# EAGLE design led_saber (EAGLE 6.4)
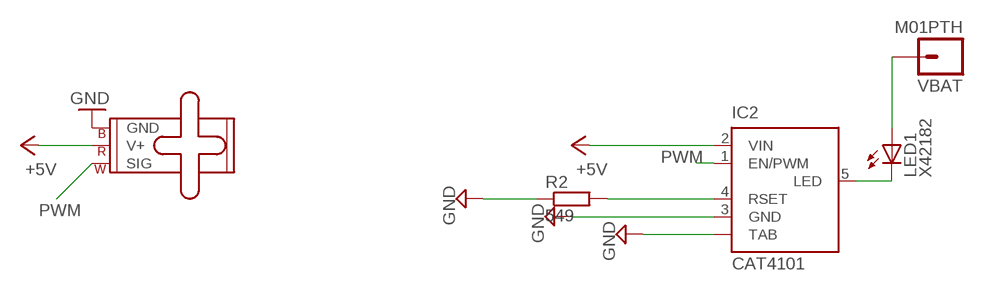
[diagram p0: schematic, sheet 1]

## Parts
IC2  CAT4101  [TO263_5]
LED  SMALL_SERVO  [1X03]
LED1  X42182  [Z-POWER-LED-DOME-TYPE]
R2  549  R-EU_R0805  [R0805]
VBAT  M01PTH  [1X01]

## Nets
+5V: IC2.2(VIN) LED.2(V+)
GND: IC2.3(GND) IC2.TAB LED.3(GND) R2.1
N$1: IC2.5(LED) LED1.C
N$2: IC2.4(RSET) R2.2
N$3: LED1.A VBAT.1
PWM: IC2.1(EN/PWM) LED.1(SIG)

## Library data of the parts
IC2 = on-semiconductor:CAT4101: 1A Constant-Current LED Driver with PWM Dimming Source: ON Semiconductor .. 4101.pdf; MPN: CAT4101TV-T75; OC_FARNELL: 1718452; OC_NEWARK: 08R5264
LED = SparkFun-Electromechanical:SMALL_SERVO: Small servo motor This is the small servo used in the SIK. SKU: ROB-09065
LED1 = led:X42182: Z-Power LED P4 Series, Dome type Source: http://www.seoulsemicon.co.kr .. X42182.pdf
R2 = resistor:R-EU_: RESISTOR, European symbol
VBAT = SparkFun-Connectors:M01: Header 1 Standard 1-pin 0.1" header. Use with straight break away headers (SKU : PRT-00116), right angle break away headers (PRT-00553), swiss pins (PRT-00743), machine pins (PRT-00117), and female headers (PRT-00115).

## Board
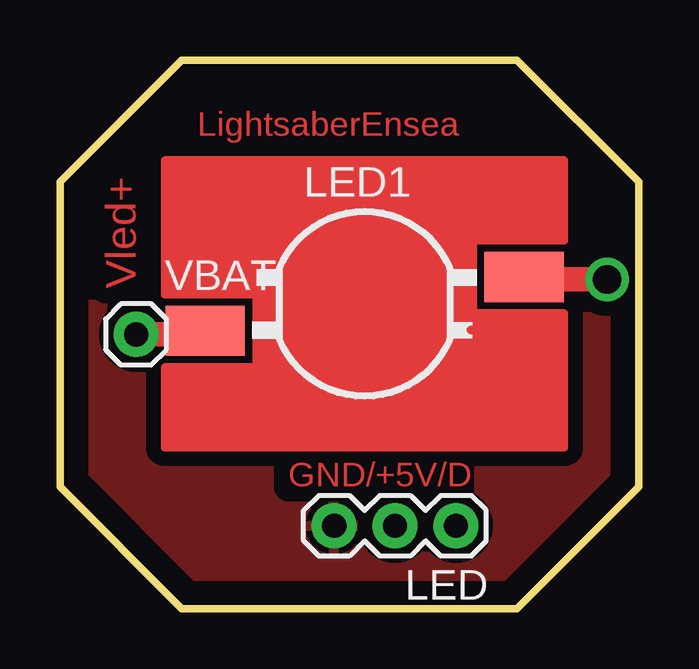
[diagram p1: board, top side]
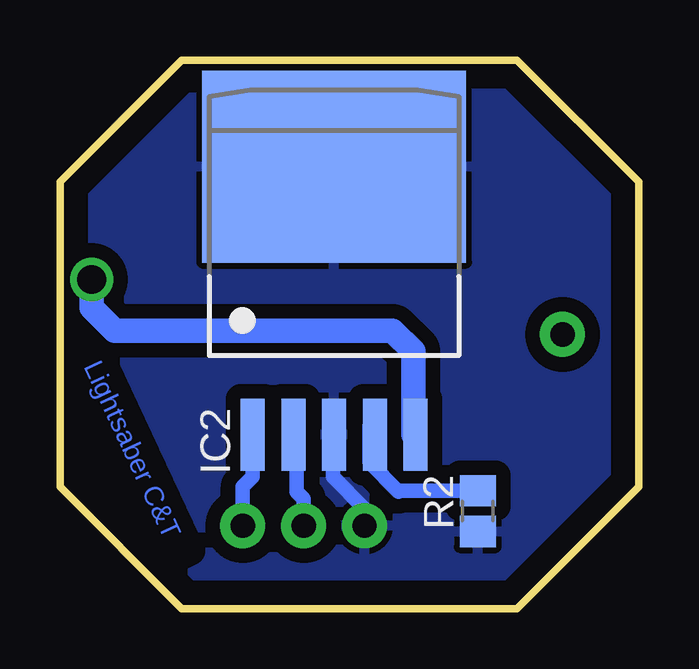
[diagram p2: board, bottom side, seen from below]

Size 24.13 x 22.86 mm. Coordinates in mm from the lower left corner, seen from the top.
Outline: 5.08,0 19.05,0 24.13,5.08 24.13,17.78 19.05,22.86 5.08,22.86 0,17.78 0,5.08 5.08,0
Copper layers (1*16): Top 0.035mm / dielectric 1.5mm / Bottom 0.035mm
Design rules "default": minimum track width 10mil, minimum drill 24mil, track to track 8mil, track to pad 8mil, pad to pad 8mil, via to via 8mil, smd to smd 8mil, copper to edge 40mil, drill to drill 8mil, minimum pad ring 10mil, minimum via ring 8mil, stop-mask expansion 4mil, vias tented up to drill 0mil, thermal gap 10mil

### Footprints (pad centres in the part's own frame; a part is rotated, then mirrored left to right if it is on the bottom)
TO263_5 = smd 1 x 3: 1 -3.4,-8; 2 -1.7,-8; 3 0,-8; 4 1.7,-8; 5 3.4,-8 | smd 11 x 8: TAB 0,3.175
1X03 = drill 1.016 pad 1.88: 1 0,0; 2 2.54,0; 3 5.08,0
Z-POWER-LED-DOME-TYPE = smd 3.3 x 2.1: A -6.65,-1.12; C 6.65,1.12
R0805 = smd 1.3 x 1.5: 1 -0.85,0; 2 0.85,0
1X01 = drill 1.016 pad 1.88: 1 0,0

### Placement (x,y rotation side)
IC2  12.7,15.24 0 bottom
LED  16.51,3.45 180 top
LED1  12.7,12.7 0 top
R2  6.71,4.06 90 bottom
VBAT  3.18,11.43 0 top

### Tracks (layer width: path | path; a pad name or v marks a point on that pad's centre or on a via)
+5V
  Bottom 0.61: LED.2 13.97,4.57 14.28,4.88 14.28,7.12 IC2.2
GND
  Bottom 0.61: LED.3 11.43,4.17 12.75,5.49 12.75,7.19 IC2.3
  pour Bottom (isolate 0.61): -3.4,29.51 27.94,29.21 29.16,-4.88 -4.32,-4.57
  pour Top (isolate 0.61): -8.99,31.45 -8.99,-6.5 31.75,-6.2 31.75,31.75
N$1  (via drill 1.2)
  Top 1.016: v22.81,13.72 19.35,13.72 LED1.C
  Bottom 1.016: IC2.5 9.4,7.24 9.4,10.72 10.26,11.58 21.84,11.58 22.81,12.55 v22.81,13.72
N$2
  Bottom 0.61: R2.2 9.97,4.91 10.01,4.88 11.23,6.1 11.23,7.62 10.92,7.92 10.92,7.32 IC2.4
N$3
  Top 1.016: VBAT.1 5.9,11.43 LED1.A
PWM
  Bottom 0.61: LED.1 16.51,5.08 16.1,5.49 IC2.1

### Text on the board
Top: LightsaberEnsea | Vled+ | Lightsaber C&T | GND/+5V/D
Bottom: Lightsaber C&T